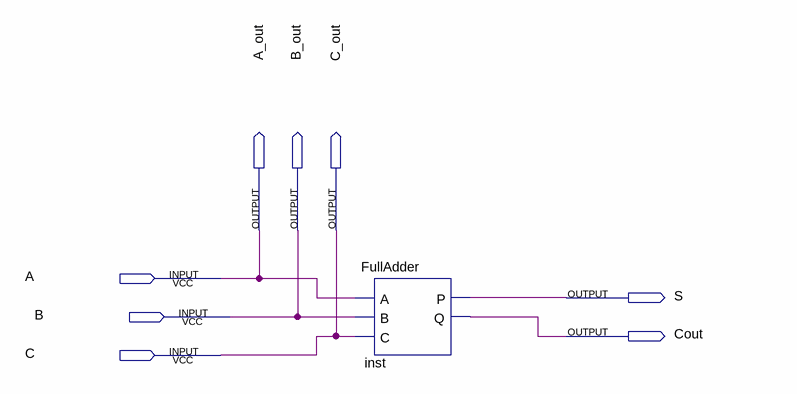
[diagram p0: schematic sheet]
// Quartus schematic Lab-5-FullAdder.bdf as structural Verilog: 1 symbols, 8 pins
module \Lab-5-FullAdder  (
  input  A,
  input  B,
  input  C,
  output A_out,
  output B_out,
  output C_out,
  output S,
  output Cout
);

  FullAdder inst (.A(A), .B(B), .C(C), .P(S), .Q(Cout));

  assign A_out = A;
  assign B_out = B;
  assign C_out = C;
endmodule
